# EAGLE design SMD FTDI (EAGLE 7.2.0)
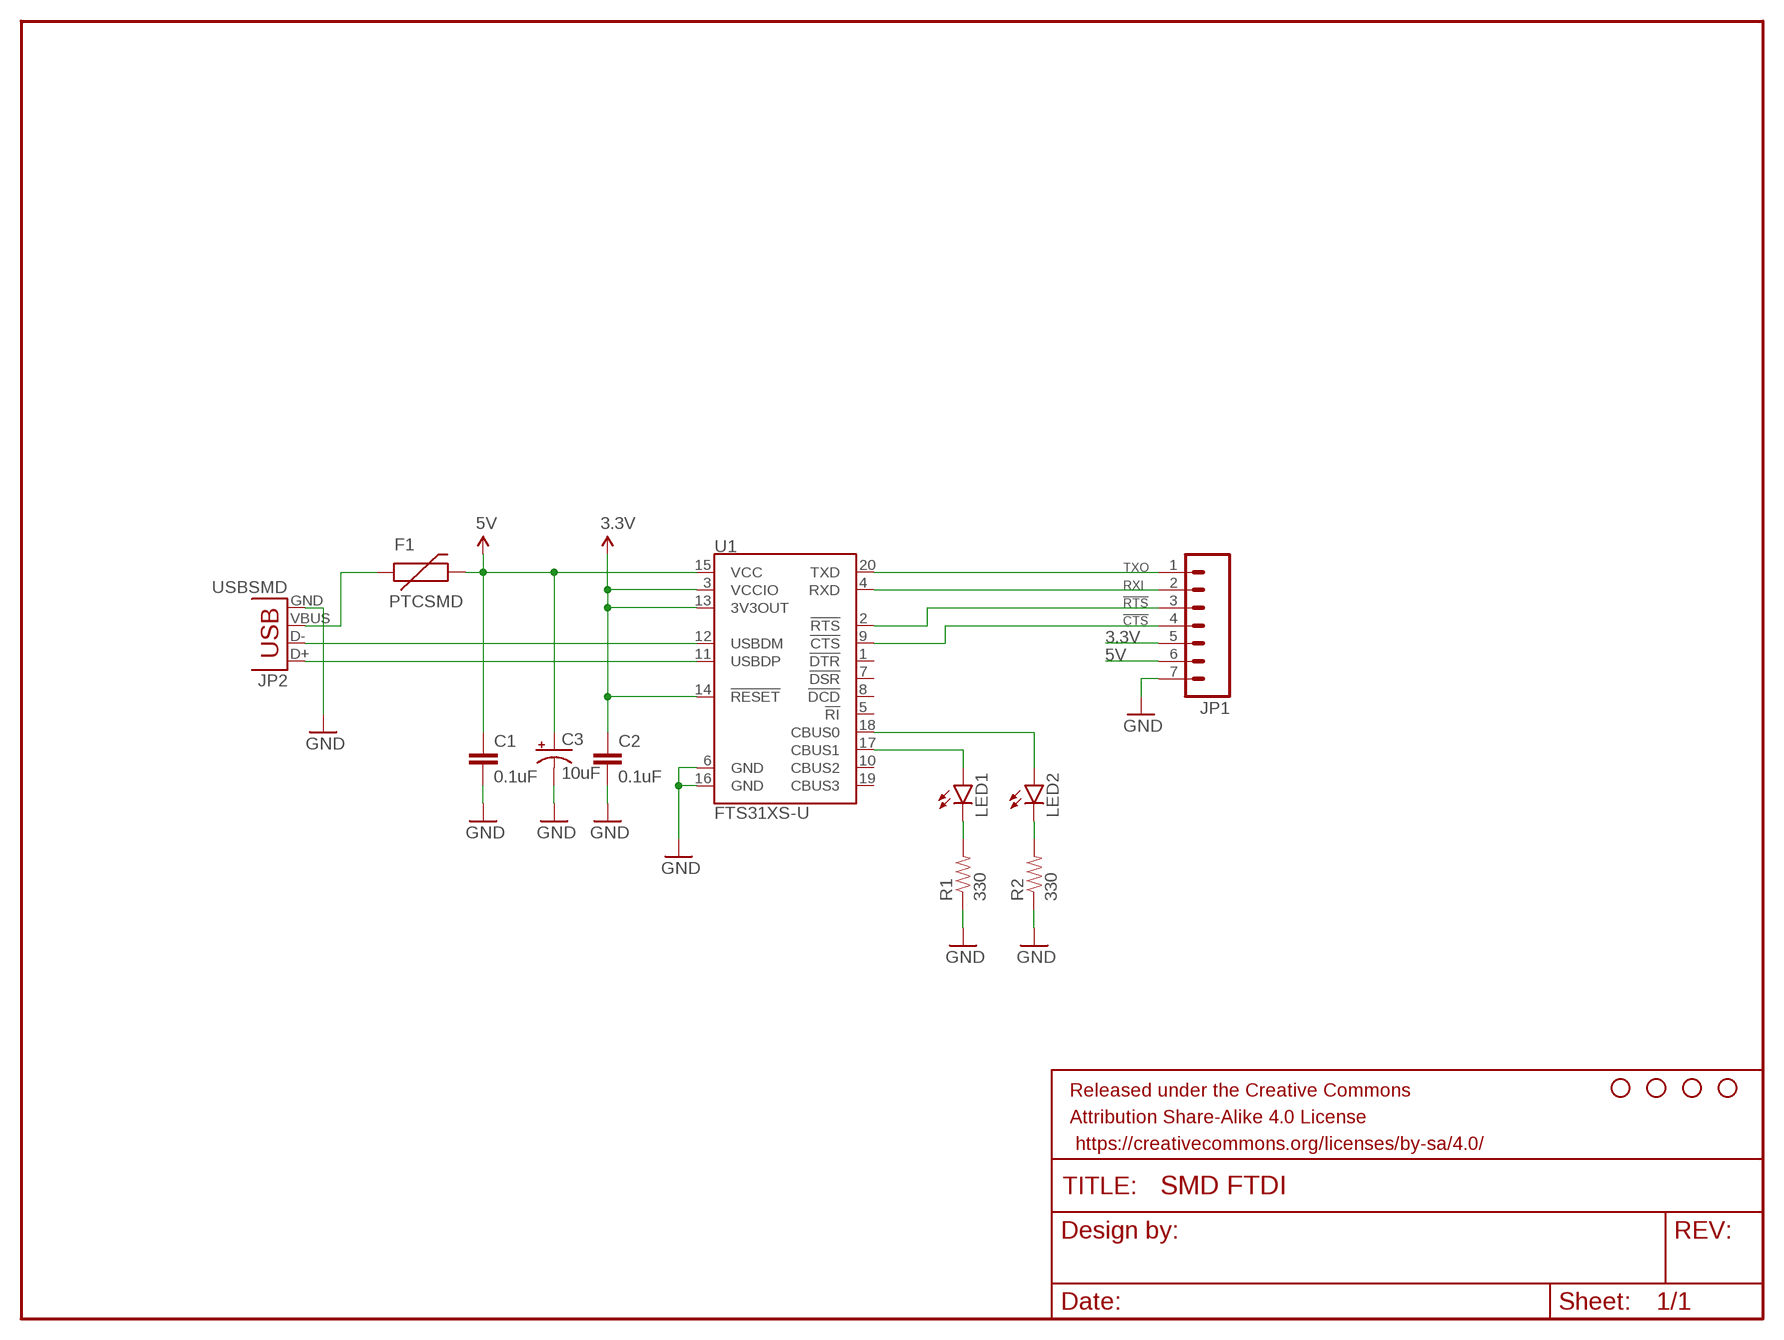
[diagram p0: schematic, sheet 1]

## Parts
C1  0.1uF  CAP0603-CAP  [0603-CAP]
C2  0.1uF  CAP0603-CAP  [0603-CAP]
C3  10uF  CAP_POL1206-KIT  [EIA3216-KIT]
F1  PTCSMD  [PTC-1206]
FRAME1  FRAME-LETTER  [CREATIVE_COMMONS]
JP1  M07  [1X07]
JP2  USBSMD  [USB-MINIB]
LED1  LED0603  [LED-0603]
LED2  LED0603  [LED-0603]
R1  330  RESISTOR0603-RES  [0603-RES]
R2  330  RESISTOR0603-RES  [0603-RES]
STANDOFF1  STAND-OFF  [STAND-OFF]
STANDOFF2  STAND-OFF  [STAND-OFF]
STANDOFF3  STAND-OFF  [STAND-OFF]
STANDOFF4  STAND-OFF  [STAND-OFF]
U1  FTS31XS-U  FT231XS  [SSOP20_L]

## Nets
3.3V: C2.1 JP1.5 U1.3(VCCIO) U1.13(3V3OUT) U1.14(!RESET)
5V: C1.1 C3.A(+) F1.2 JP1.6 U1.15(VCC)
!CTS: JP1.4 U1.9(!CTS)
!RTS: JP1.3 U1.2(!RTS)
GND: C1.2 C2.2 C3.C(-) JP1.7 JP2.GND R1.1 R2.1 U1.6(GND) U1.16(GND)
N$1: JP2.D- U1.12(USBDM)
N$2: JP2.D+ U1.11(USBDP)
N$3: F1.1 JP2.VBUS
N$6: LED2.A U1.18(CBUS0)
N$7: LED1.A U1.17(CBUS1)
N$8: LED1.C R1.2
N$9: LED2.C R2.2
RXI: JP1.2 U1.4(RXD)
TXO: JP1.1 U1.20(TXD)
Unconnected: U1.1(!DTR) U1.5(!RI) U1.7(!DSR) U1.8(!DCD) U1.10(CBUS2) U1.19(CBUS3)

## Library data of the parts
C1 C2 = SparkFun-Passives:CAP: Capacitor Standard 0603 ceramic capacitor, and 0.1" leaded capacitor.
C3 = SparkFun-Passives:CAP_POL: Capacitor Polarized These are standard SMD and PTH capacitors. Normally 10uF, 47uF, and 100uF in electrolytic and tantalum varieties. Always verify the external diameter of the through hole cap, it varies with capacity, voltage, and manufacturer. The EIA devices should be standard.
F1 = SparkFun-PowerIC:PTC: Resettable Fuse PTC Resettable Fuse. Spark Fun Electronics SKU : COM-08357; PROD_ID: RES-11150
FRAME1 = SparkFun-Aesthetics:FRAME-LETTER: Schematic Frame Standard 8.5x11 US Letter frame; DESIGNER: NAME; VERSION: v01
JP1 = SparkFun-Connectors:M07: Header 7 Standard 7-pin 0.1" header. Use with straight break away headers (SKU : PRT-00116), right angle break away headers (PRT-00553), swiss pins (PRT-00743), machine pins (PRT-00117), and female headers (PRT-00115). NOTES ON THE VARIANTS LOCK and LOCK_LONGPADS... This footprint was designed to help hold the alignment of a through-hole component (i.e. 7-pin header) while soldering it into place. You may notice that each hole has been shifted either up or down by 0.005 of an inch from it's more standard position (which is usually a perfectly straight line). This slight alteration caused the pins (the squares in the middle) to touch the edges of the holes. Because they are alternating, it causes a "brace" to hold the header in place. 0.005 has proven to be the perfect amount of "off-center" position when using our standard breakaway headers. Although looks a little odd when you look at the bare footprint, once you have a header in there, the alteration is very hard to notice. Also, if you push a header all the way into place, it is covered up entirely on the bottom side. This idea of altering the position of holes to aid alignment will be further integrated into the Sparkfun Library for other footprints. It can help hold any component with 3 or more connection pins.
JP2 = SparkFun-Connectors:USB: USB Connectors USB-B-PTH is fully proven SKU : PRT-00139/CONN-08278 USB-miniB is fully proven SKU : PRT-00587 USB-A-PCB is untested. USB-A-H is throughly reviewed, but untested. Spark Fun Electronics SKU : PRT-00437 USB-B-SMT is throughly reviewed, but untested. Needs silkscreen touching up. USB-A-S has not been used/tested USB-MB-H has not been used/tested USB-MICROB has been used. CONN-09505; PROD_ID: CONN-08193
LED1 LED2 = SparkFun-LED:LED: LEDs Standard schematic elements and footprints for 5mm, 3mm, 1206, and 0603 sized LEDs. 5mm - Spark Fun Electronics SKU : COM-00529 (and others)
R1 R2 = SparkFun-Passives:RESISTOR: Resistor Basic schematic elements and footprints for 0603, 1206, and PTH resistors.
STANDOFF1-STANDOFF4 = SparkFun-Electromechanical:STAND-OFF: #4 Stand Off This is the mechanical footprint for a #4 phillips button head screw. Use the keepout ring to avoid running the screw head into surrounding components. SKU : PRT-00447
U1 = SparkFun-DigitalIC:FT231X: FTDI FT231X Full Speed USB to Full-handshake UART This USB2.0 Full Speed IC offers a compact bridge to full handshake UART interfaces. The device is a UART, capable of operating up to 3MBaud, with low power consumption (8mA). The FT231X includes the complete FT-X series feature set and enables USB to be added into a system design quickly and easily over a UART interface.; PROD_ID: IC-11524

## Board
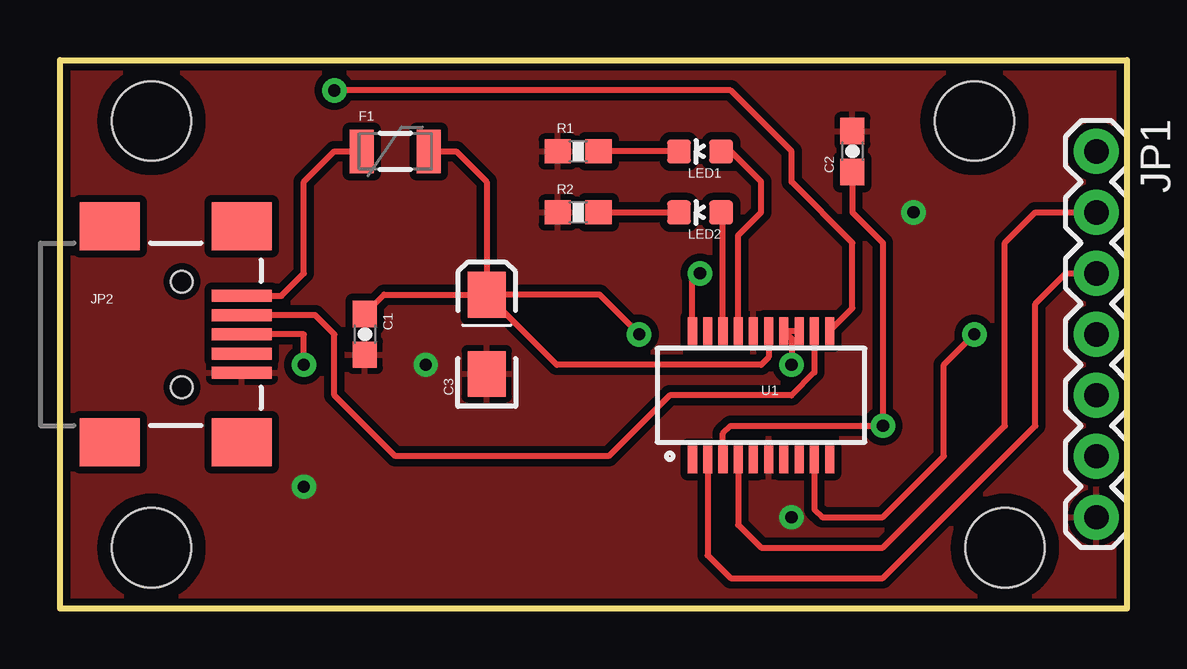
[diagram p1: board, top side]
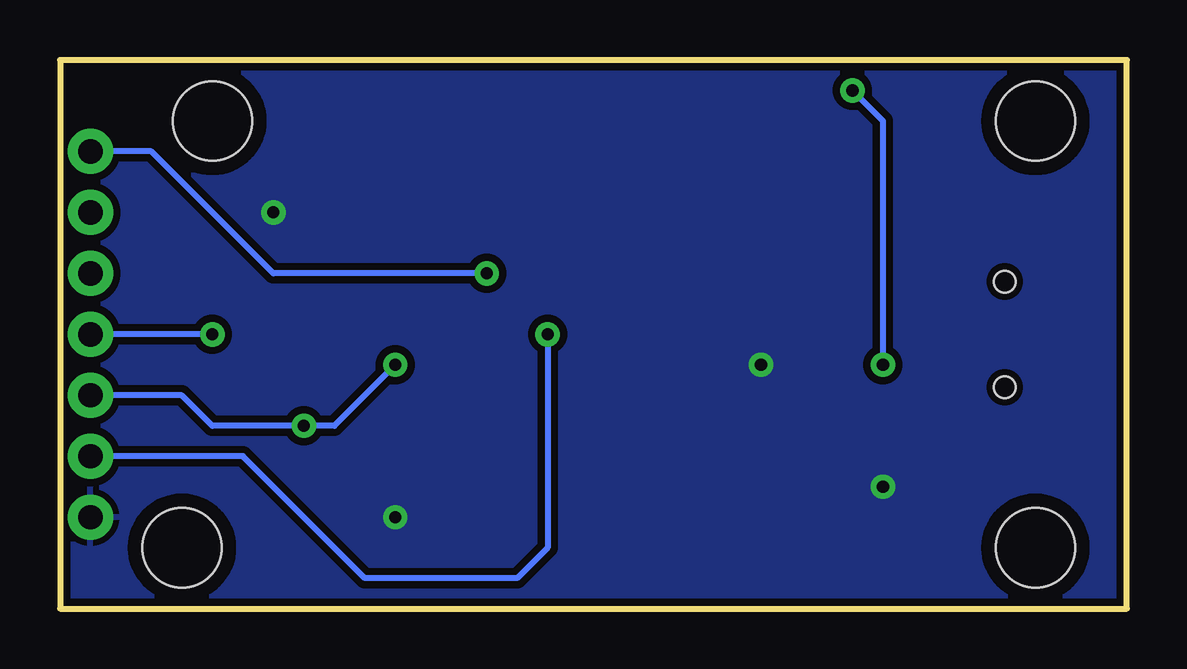
[diagram p2: board, bottom side, seen from below]

Size 44.45 x 22.86 mm. Coordinates in mm from the lower left corner, seen from the top.
Outline: 0,0 0,22.86 44.45,22.86 44.45,0 0,0
Copper layers (1*16): Top 0.035mm / dielectric 1.5mm / Bottom 0.035mm
Design rules "SparkFun": minimum track width 8mil, minimum drill 20mil, track to track 8mil, track to pad 8mil, pad to pad 8mil, via to via 8mil, smd to smd 8mil, copper to edge 8mil, drill to drill 8mil, minimum pad ring 12mil, minimum via ring 10mil, stop-mask expansion 4mil, vias tented up to drill 20mil, thermal gap 10mil

### Footprints (pad centres in the part's own frame; a part is rotated, then mirrored left to right if it is on the bottom)
0603-CAP = smd 1.1 x 1: 1 -0.85,0; 2 0.85,0
EIA3216-KIT = smd 1.9 x 1.6: A 1.65,0; C -1.65,0
PTC-1206 = smd 1 x 1.8: 1 -1.4,0; 2 1.4,0
1X07 = drill 1.016 pad 1.88: 1 0,0; 2 2.54,0; 3 5.08,0; 4 7.62,0; 5 10.16,0; 6 12.7,0; 7 15.24,0
USB-MINIB = smd 2.5 x 0.5: D+ 2.5,0; D- 2.5,0.8; GND 2.5,-1.6; ID 2.5,-0.8; VBUS 2.5,1.6 | smd 2.5 x 2: MTN1 -3,4.5; MTN2 2.5,4.5; MTN3 -3,-4.5; MTN4 2.5,-4.5 | hole 0.9: 0,2.2; 0,-2.2
LED-0603 = smd 1 x 1: A 0,-0.877; C 0,0.877
0603-RES = smd 1.1 x 1: 1 -0.85,0; 2 0.85,0
STAND-OFF = hole 3.302: 0,0
SSOP20_L = smd 0.381 x 1.143: 1 -2.857,-2.68; 2 -2.223,-2.68; 3 -1.587,-2.68; 4 -0.953,-2.68; 5 -0.318,-2.68; 6 0.318,-2.68; 7 0.953,-2.68; 8 1.587,-2.68; 9 2.223,-2.68; 10 2.857,-2.68; 11 2.857,2.68; 12 2.223,2.68; 13 1.587,2.68; 14 0.953,2.68; 15 0.318,2.68; 16 -0.318,2.68; 17 -0.953,2.68; 18 -1.587,2.68; 19 -2.223,2.68; 20 -2.857,2.68

### Placement (x,y rotation side)
C1  12.7,11.43 270 top
C2  33.02,19.05 90 top
C3  17.78,11.43 90 top
F1  13.97,19.05 0 top
FRAME1  -13.97,-10.16 0 top  (outside the outline)
JP1  43.18,19.05 270 top
JP2  5.08,11.43 0 top
LED1  26.67,19.05 90 top
LED2  26.67,16.51 90 top
R1  21.59,19.05 0 top
R2  21.59,16.51 0 top
STANDOFF1  39.37,2.54 0 top
STANDOFF2  38.1,20.32 0 top
STANDOFF3  3.81,2.54 0 top
STANDOFF4  3.81,20.32 0 top
U1  29.21,8.89 0 top

### Tracks (layer width: path | path; a pad name or v marks a point on that pad's centre or on a via)
3.3V  (via drill 0.51)
  Top 0.254: U1.13 U1.14 30.48,11.25 v30.48,10.16 | C2.1 33.02,16.51 34.29,15.24 v34.29,7.62 27.94,7.62 27.62,7.3 U1.3
  Bottom 0.254: JP1.5 39.37,8.89 38.1,7.62 v34.29,7.62 33.02,7.62 v30.48,10.16
5V  (via drill 0.51)
  Top 0.254: C1.1 13.5,13.08 C3.A | F1.2 16.51,19.05 17.78,17.78 C3.A | U1.15 29.53,10.48 29.21,10.16 20.7,10.16 C3.A | v24.13,11.43 22.48,13.08 C3.A
  Bottom 0.254: JP1.6 36.83,6.35 31.75,1.27 25.4,1.27 24.13,2.54 v24.13,11.43
!CTS  (via drill 0.51)
  Top 0.254: U1.9 31.43,4.13 31.75,3.81 34.29,3.81 36.83,6.35 36.83,10.16 v38.1,11.43
  Bottom 0.254: v38.1,11.43 JP1.4
!RTS
  Top 0.254: JP1.3 41.91,13.97 40.64,12.7 40.64,7.62 34.29,1.27 27.94,1.27 26.99,2.22 U1.2
GND  (via drill 0.51)
  other vias: 15.24,10.16 35.56,16.51 10.16,5.08 30.48,3.81
  pour Top (isolate 0.305): 0,0 0,22.86 44.45,22.86 44.45,0
  pour Bottom (isolate 0.305): 0,0 0,22.86 44.45,22.86 44.45,0
N$1
  Top 0.254: U1.12 31.43,9.84 30.48,8.89 25.4,8.89 22.86,6.35 13.97,6.35 11.43,8.89 11.43,11.43 10.63,12.23 JP2.D-
N$2  (via drill 0.51)
  Top 0.254: U1.11 33.02,12.52 33.02,15.24 30.48,17.78 30.48,19.05 27.94,21.59 v11.43,21.59 | v10.16,10.16 10.16,11.43 JP2.D+
  Bottom 0.254: v11.43,21.59 10.16,20.32 v10.16,10.16
N$3
  Top 0.254: JP2.VBUS 9.22,13.03 10.16,13.97 10.16,17.78 11.43,19.05 F1.1
N$6
  Top 0.254: U1.18 27.62,16.43 LED2.A
N$7
  Top 0.254: U1.17 28.26,15.56 29.21,16.51 29.21,17.78 27.94,19.05 LED1.A
N$8
  Top 0.254: LED1.C R1.2
N$9
  Top 0.254: R2.2 LED2.C
RXI
  Top 0.254: U1.4 28.26,3.49 29.21,2.54 34.29,2.54 39.37,7.62 39.37,15.24 40.64,16.51 JP1.2
TXO  (via drill 0.51)
  Top 0.254: U1.20 26.35,13.65 v26.67,13.97
  Bottom 0.254: v26.67,13.97 35.56,13.97 40.64,19.05 JP1.1